# Altium schematic sheet РЕУН.468172.001_Interface.SchDoc: =Name-1str
size 420 x 297 mm; SheetNumber: 4; Вид изделия: Документация; Раздел: Документация; Код документа: Э3; Вид документа: Схема электрическая принципиальная; Класс документа: Конструкторский документ; Создавать изделие в PLM: Yes; DocumentCode: РЕУН.468172.001 Э3 2D; DocumentView: Схема электрическая принципиальная; DocumentClass: Конструкторский документ; ProductView: Документация; Format: А3
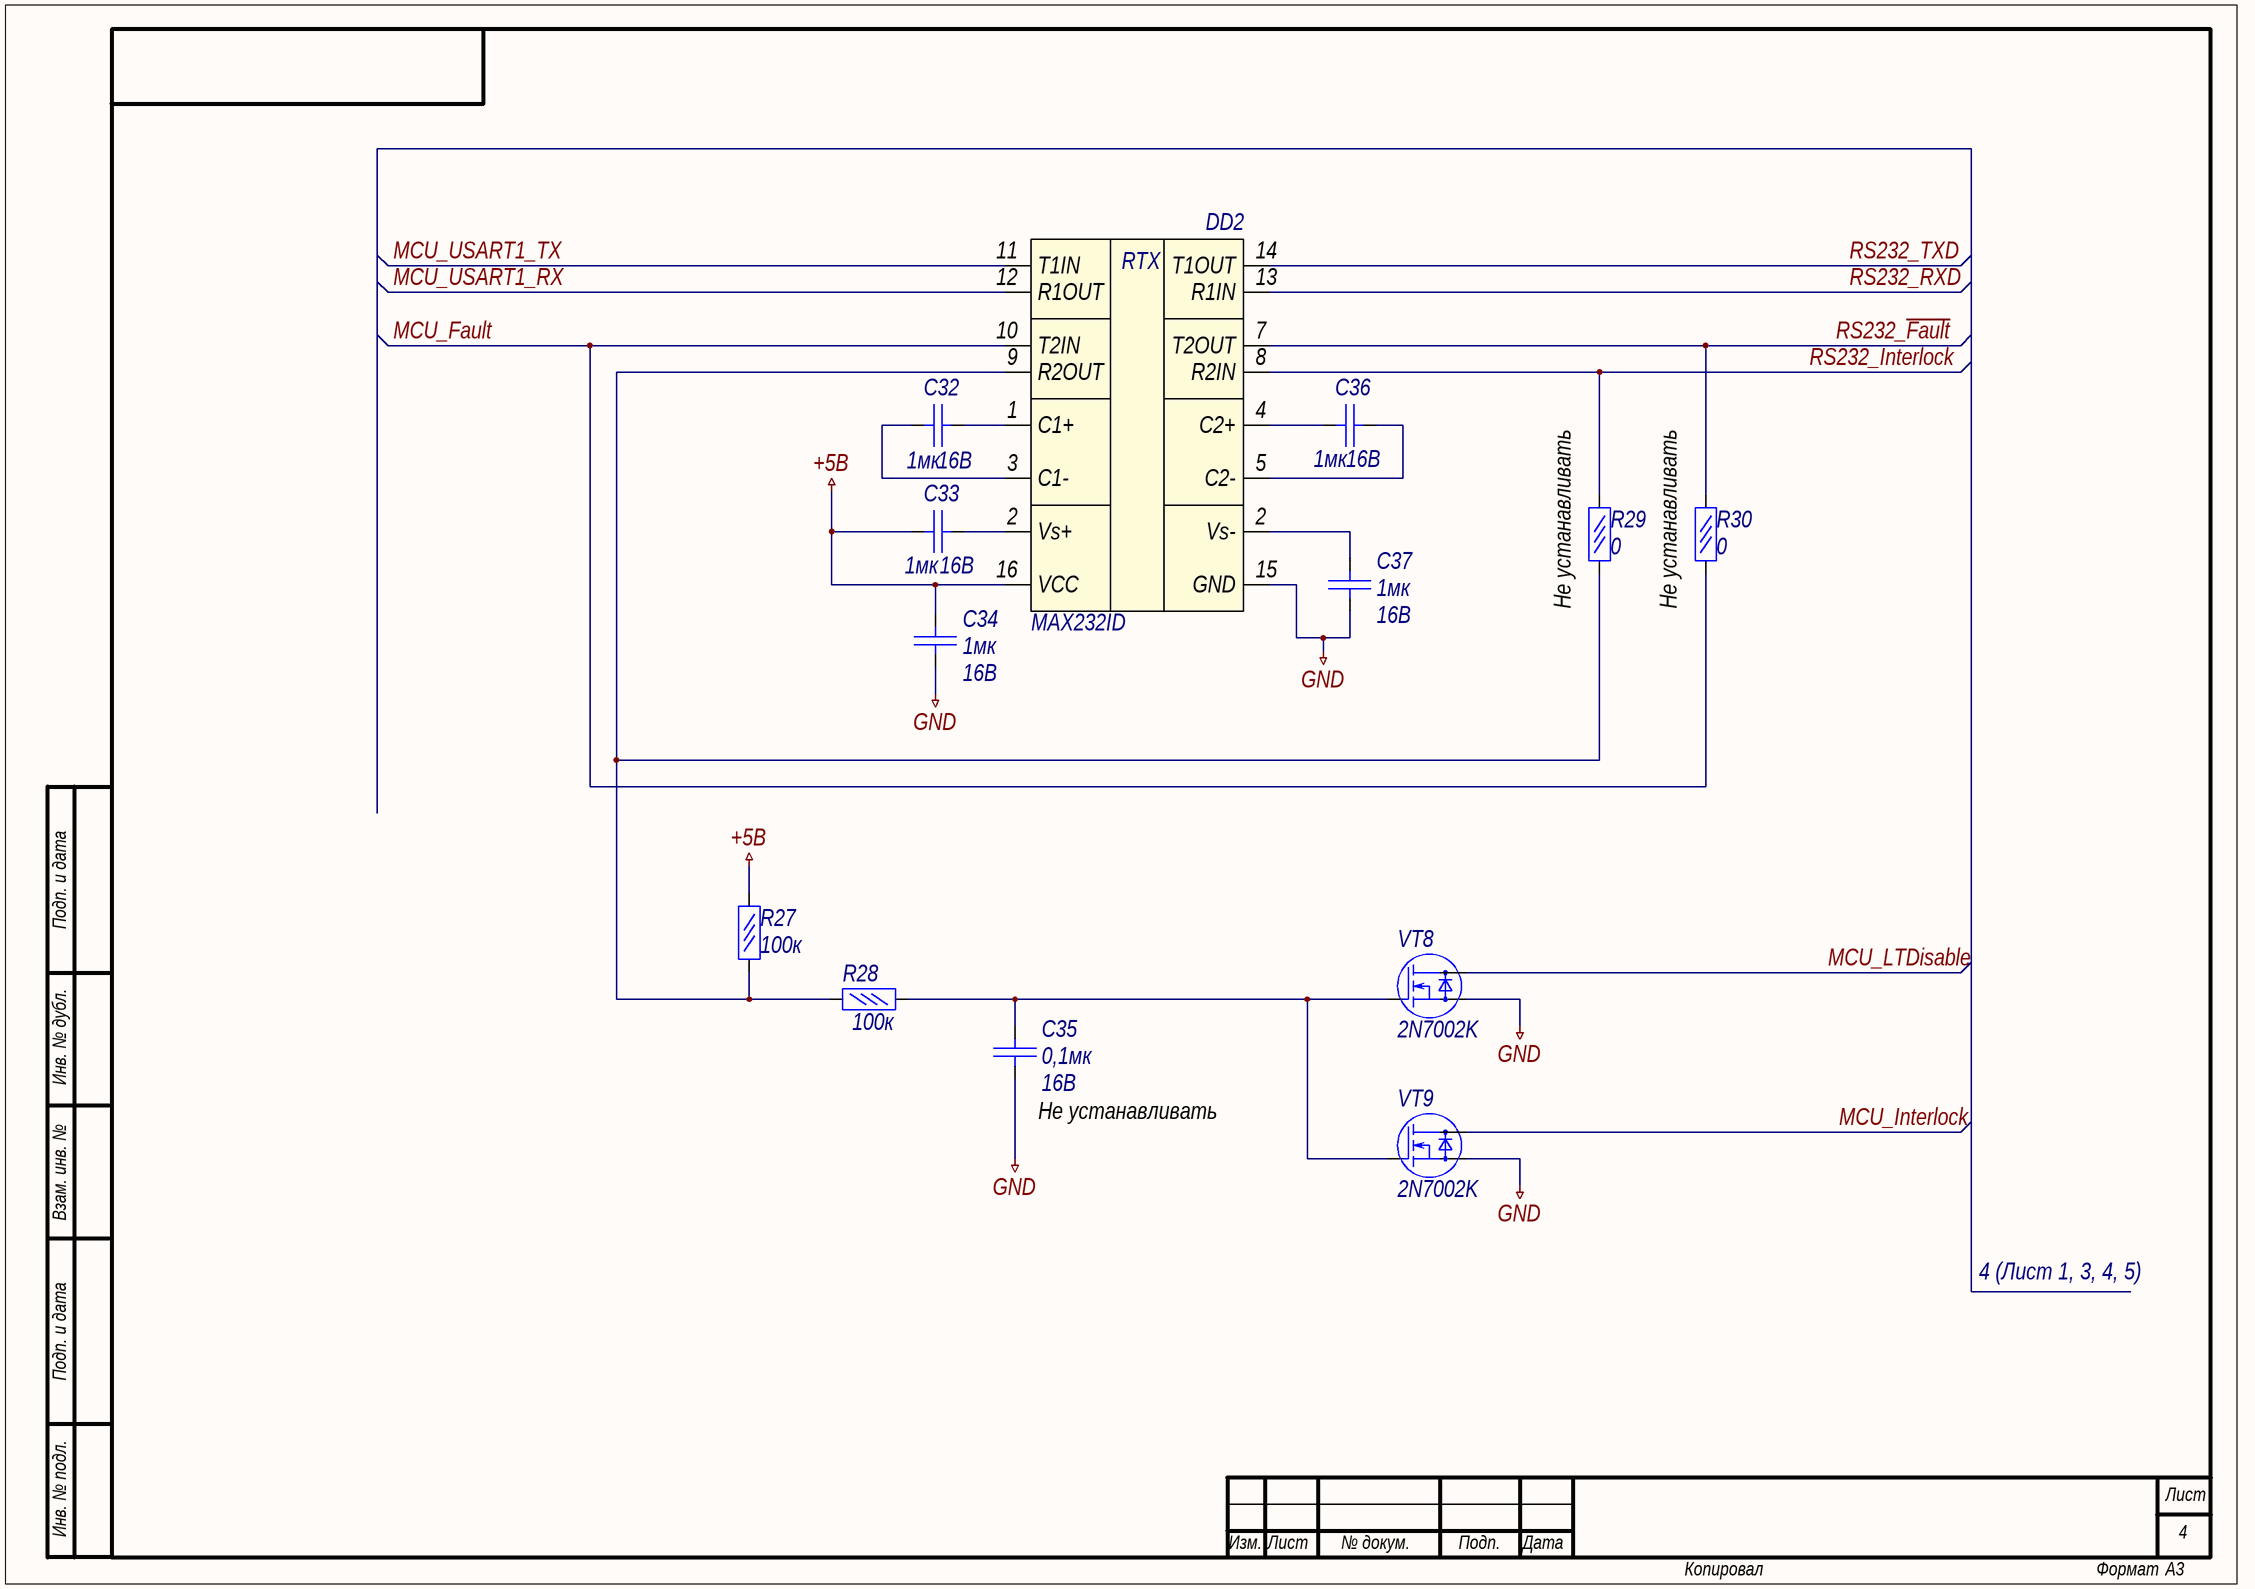
[diagram p0: РЕУН.468172.001_Interface.SchDoc]

## Parts
C32  Voltage: 16В  [C0805_AA]  (hidden comment: 1мк)
C33  Voltage: 16В  [C0805_AA]  (hidden comment: 1мк)
C34  Voltage: 16В  [C0805_AA]  (hidden comment: 1мк)
C35  Voltage: 16В  [C0805_AA]  (hidden comment: 0,1мк)
C36  Voltage: 16В  [C0805_AA]  (hidden comment: 1мк)
C37  Voltage: 16В  [C0805_AA]  (hidden comment: 1мк)
DD2  MAX232ID
R27  100к  [R1206]
R28  100к  [R1206]
R29  0  [R1206]
R30  0  [R1206]
VT8  2N7002K  [SOT23-3]
VT9  2N7002K  [SOT23-3]

## Nets
+5В: C33.2 C34.1 DD2.16(VCC) R27.1
GND: C34.2 C35.2 C37.2 DD2.15(GND) VT8.2(S) VT9.2(S)
MCU_Fault: DD2.10(T2IN) R30.2
MCU_Interlock: VT9.3(D)
MCU_LTDisable: VT8.3(D)
MCU_USART1_RX: DD2.12(R1OUT)
MCU_USART1_TX: DD2.11(T1IN)
RS232_~{Fault}: DD2.7(T2OUT) R30.1
RS232_Interlock: DD2.8(R2IN) R29.1
RS232_RXD: DD2.13(R1IN)
RS232_TXD: DD2.14(T1OUT)
NetC32_1: C32.1 DD2.1(C1+)
NetC32_2: C32.2 DD2.3(C1-)
NetC33_1: C33.1 DD2.2(Vs+)
NetC35_1: C35.1 R28.1 VT8.1(G) VT9.1(G)
NetC36_1: C36.1 DD2.5(C2-)
NetC36_2: C36.2 DD2.4(C2+)
NetC37_1: C37.1 DD2.2(Vs-)
NetDD2_9: DD2.9(R2OUT) R27.2 R28.2 R29.2

## Notes on the sheet
- (near R29) Не устанавливать
- (near R30) Не устанавливать
- (near C35) Не устанавливать
- 4 (Лист 1, 3, 4, 5)
- Подп. и дата
- Инв. № дубл.
- Взам. инв. №
- Инв. № подл.
- Лист
- Изм.
- № докум.
- Подп.
- Дата
- Копировал
- Формат
- (in symbol MAX232ID) RTX

## Library data of the parts
C32-C37 = Конденсатор кер.: Name: CC0603KRX7R7BB105
  C32-C34 C36 C37: Value: 1мк
  C35: Value: 0,1мк
DD2 = MAX232ID: Dual EIA-232 Drivers/Receivers
R27-R30 = Резистор  0,05Вт: Резистор 0,05Вт; Name: RC0603FR-0710KL; Power rating: 0,05Вт
  R27 R28: Value: 100к
  R29 R30: Value: 0
VT8 VT9 = mosfet-n: Name: 2N7002K